# Altium project Chair_Speaker_TI_Receiver_REV1-1.PrjPcb
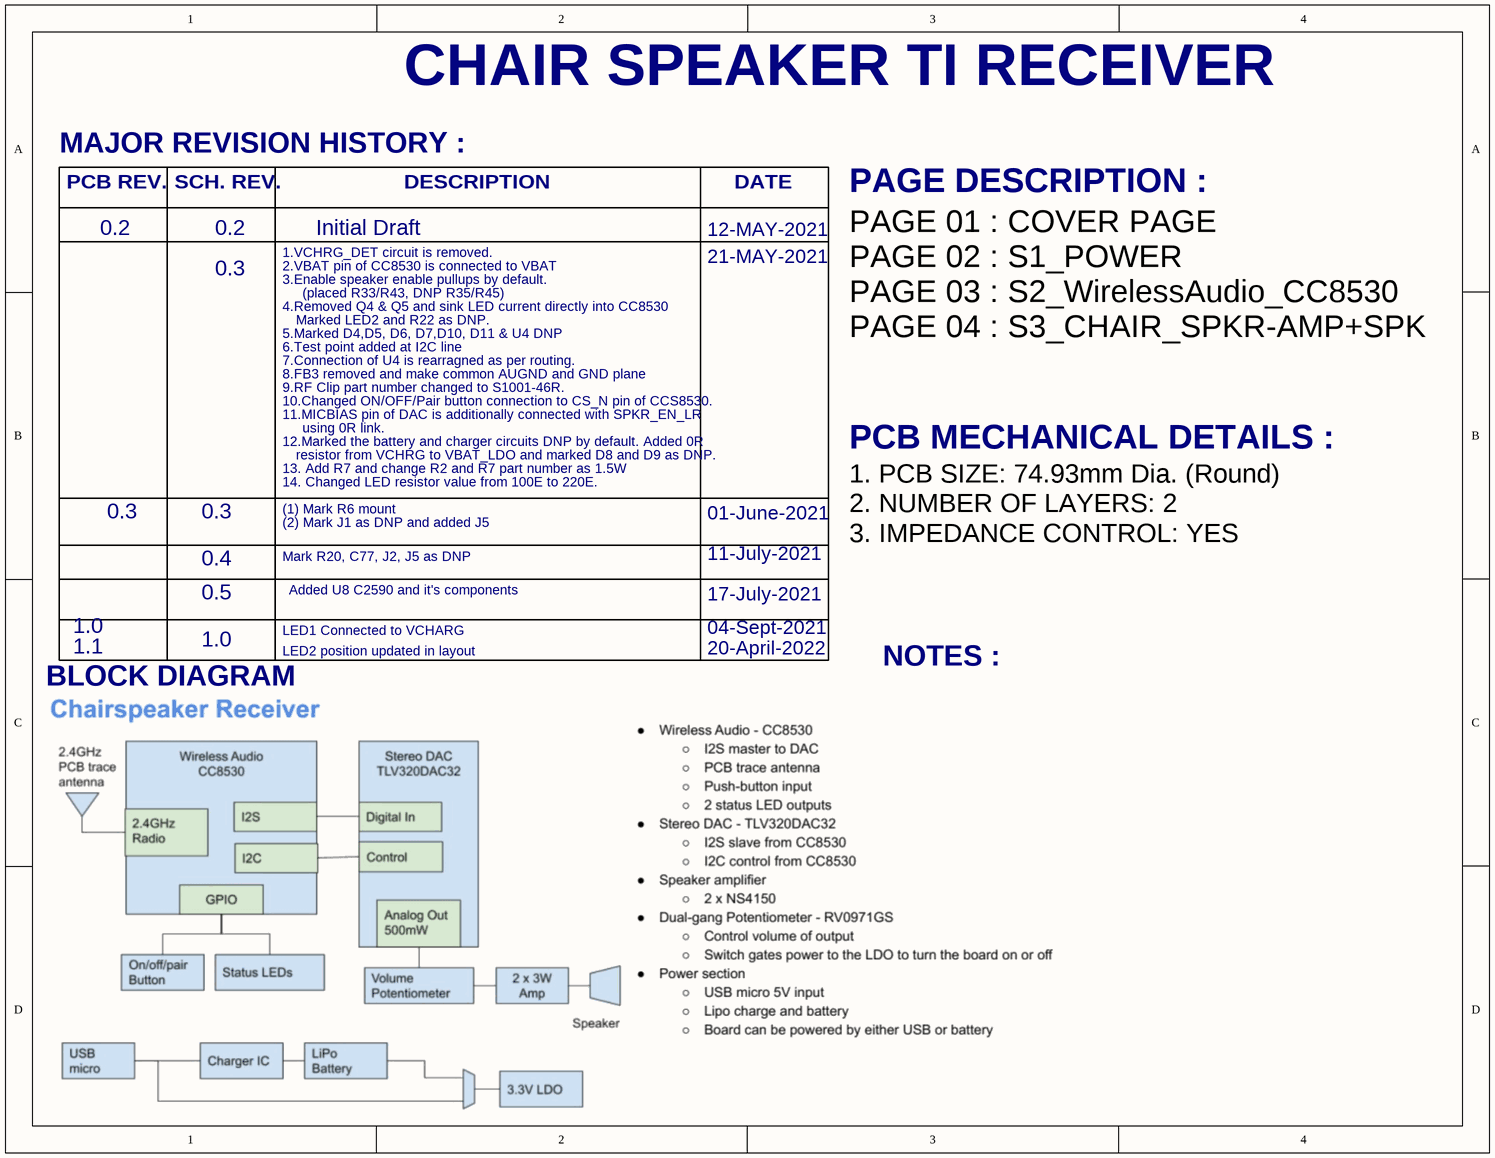
[diagram p0: S0_COVER_PAGE.SchDoc]
GlobalProjectRevision: REV1-1; GlobalProjectName: Chairspeaker TI Receiver; .PCBSolderMaskSides: Both; .PCBSolderMaskColor: Green; .PCBSilkscreenSides: Both; .PCBSilkscreenColor: White; .PCBFinishThickness: 1.6; .pcbfinishPlating: ENIG; .GlobalProjectCustomer: Plastimold
4 sheets, 184 parts. Net scope: global (net labels, ports and power ports of the same name join across sheets).
Board file: Chair_Speaker_TI_Receiver_REV1-1.PcbDoc
Sheets:
  S0_COVER_PAGE.SchDoc
  S1_POWER.SchDoc
  S2_WirelessAudio_CC8530.SchDoc
  S3_CHAIR_SPKR-AMP+SPK.SchDoc

## Sheet S0_COVER_PAGE.SchDoc
size Letter; DocumentNumber: 1; Revision: 1-0; SheetNumber: 0; SheetTotal: 6

### Notes on the sheet
- CHAIR SPEAKER TI RECEIVER
- MAJOR REVISION HISTORY :
- PCB REV.
- 0.2
- SCH. REV.
- Initial Draft
- DESCRIPTION
- 12-MAY-2021
- DATE
- PAGE DESCRIPTION :
- 0.3
- 1.VCHRG_DET circuit is removed.
- 2.VBAT pin of CC8530 is connected to VBAT
- 3.Enable speaker enable pullups by default.
- (placed R33/R43, DNP R35/R45)
- 21-MAY-2021
- 4.Removed Q4 & Q5 and sink LED current directly into CC8530
- 5.Marked D4,D5, D6, D7,D10, D11 & U4 DNP
- 6.Test point added at I2C line
- 7.Connection of U4 is rearragned as per routing.
- Marked LED2 and R22 as DNP.
- PAGE 01 : COVER PAGE
  PAGE 02 : S1_POWER
  PAGE 03 : S2_WirelessAudio_CC8530
  PAGE 04 : S3_CHAIR_SPKR-AMP+SPK
- 8.FB3 removed and make common AUGND and GND plane
- 9.RF Clip part number changed to S1001-46R.
- 10.Changed ON/OFF/Pair button connection to CS_N pin of CCS8530.
- 11.MICBIAS pin of DAC is additionally connected with SPKR_EN_LR
- using 0R link.
- 12.Marked the battery and charger circuits DNP by default. Added 0R
- 13. Add R7 and change R2 and R7 part number as 1.5W
- 14. Changed LED resistor value from 100E to 220E.
- resistor from VCHRG to VBAT_LDO and marked D8 and D9 as DNP.
- PCB MECHANICAL DETAILS :
- 0.4
- (1) Mark R6 mount
- (2) Mark J1 as DNP and added J5
- Mark R20, C77, J2, J5 as DNP
- 01-June-2021
- 11-July-2021
- 1. PCB SIZE: 74.93mm Dia. (Round)
  2. NUMBER OF LAYERS: 2
  3. IMPEDANCE CONTROL: YES
- 1.0
- 0.5
- LED1 Connected to VCHARG
- Added U8 C2590 and it's components
- 17-July-2021
- 04-Sept-2021
- BLOCK DIAGRAM
- 1.1
- LED2 position updated in layout
- 20-April-2022
- NOTES :
- Title
- Size:
- Date:
- B
- Number:
- Time:
- Revision:
- Sheet
- of
- File:

## Sheet S1_POWER.SchDoc
size 431 x 279 mm; Revision: 1-0; SheetNumber: 2; SheetTotal: 4; CustomerName: PLASTIMOLD; .GlobalProjectCustomer: PLASTIMOLD; ProjectName: Chairspeaker TI Receiver
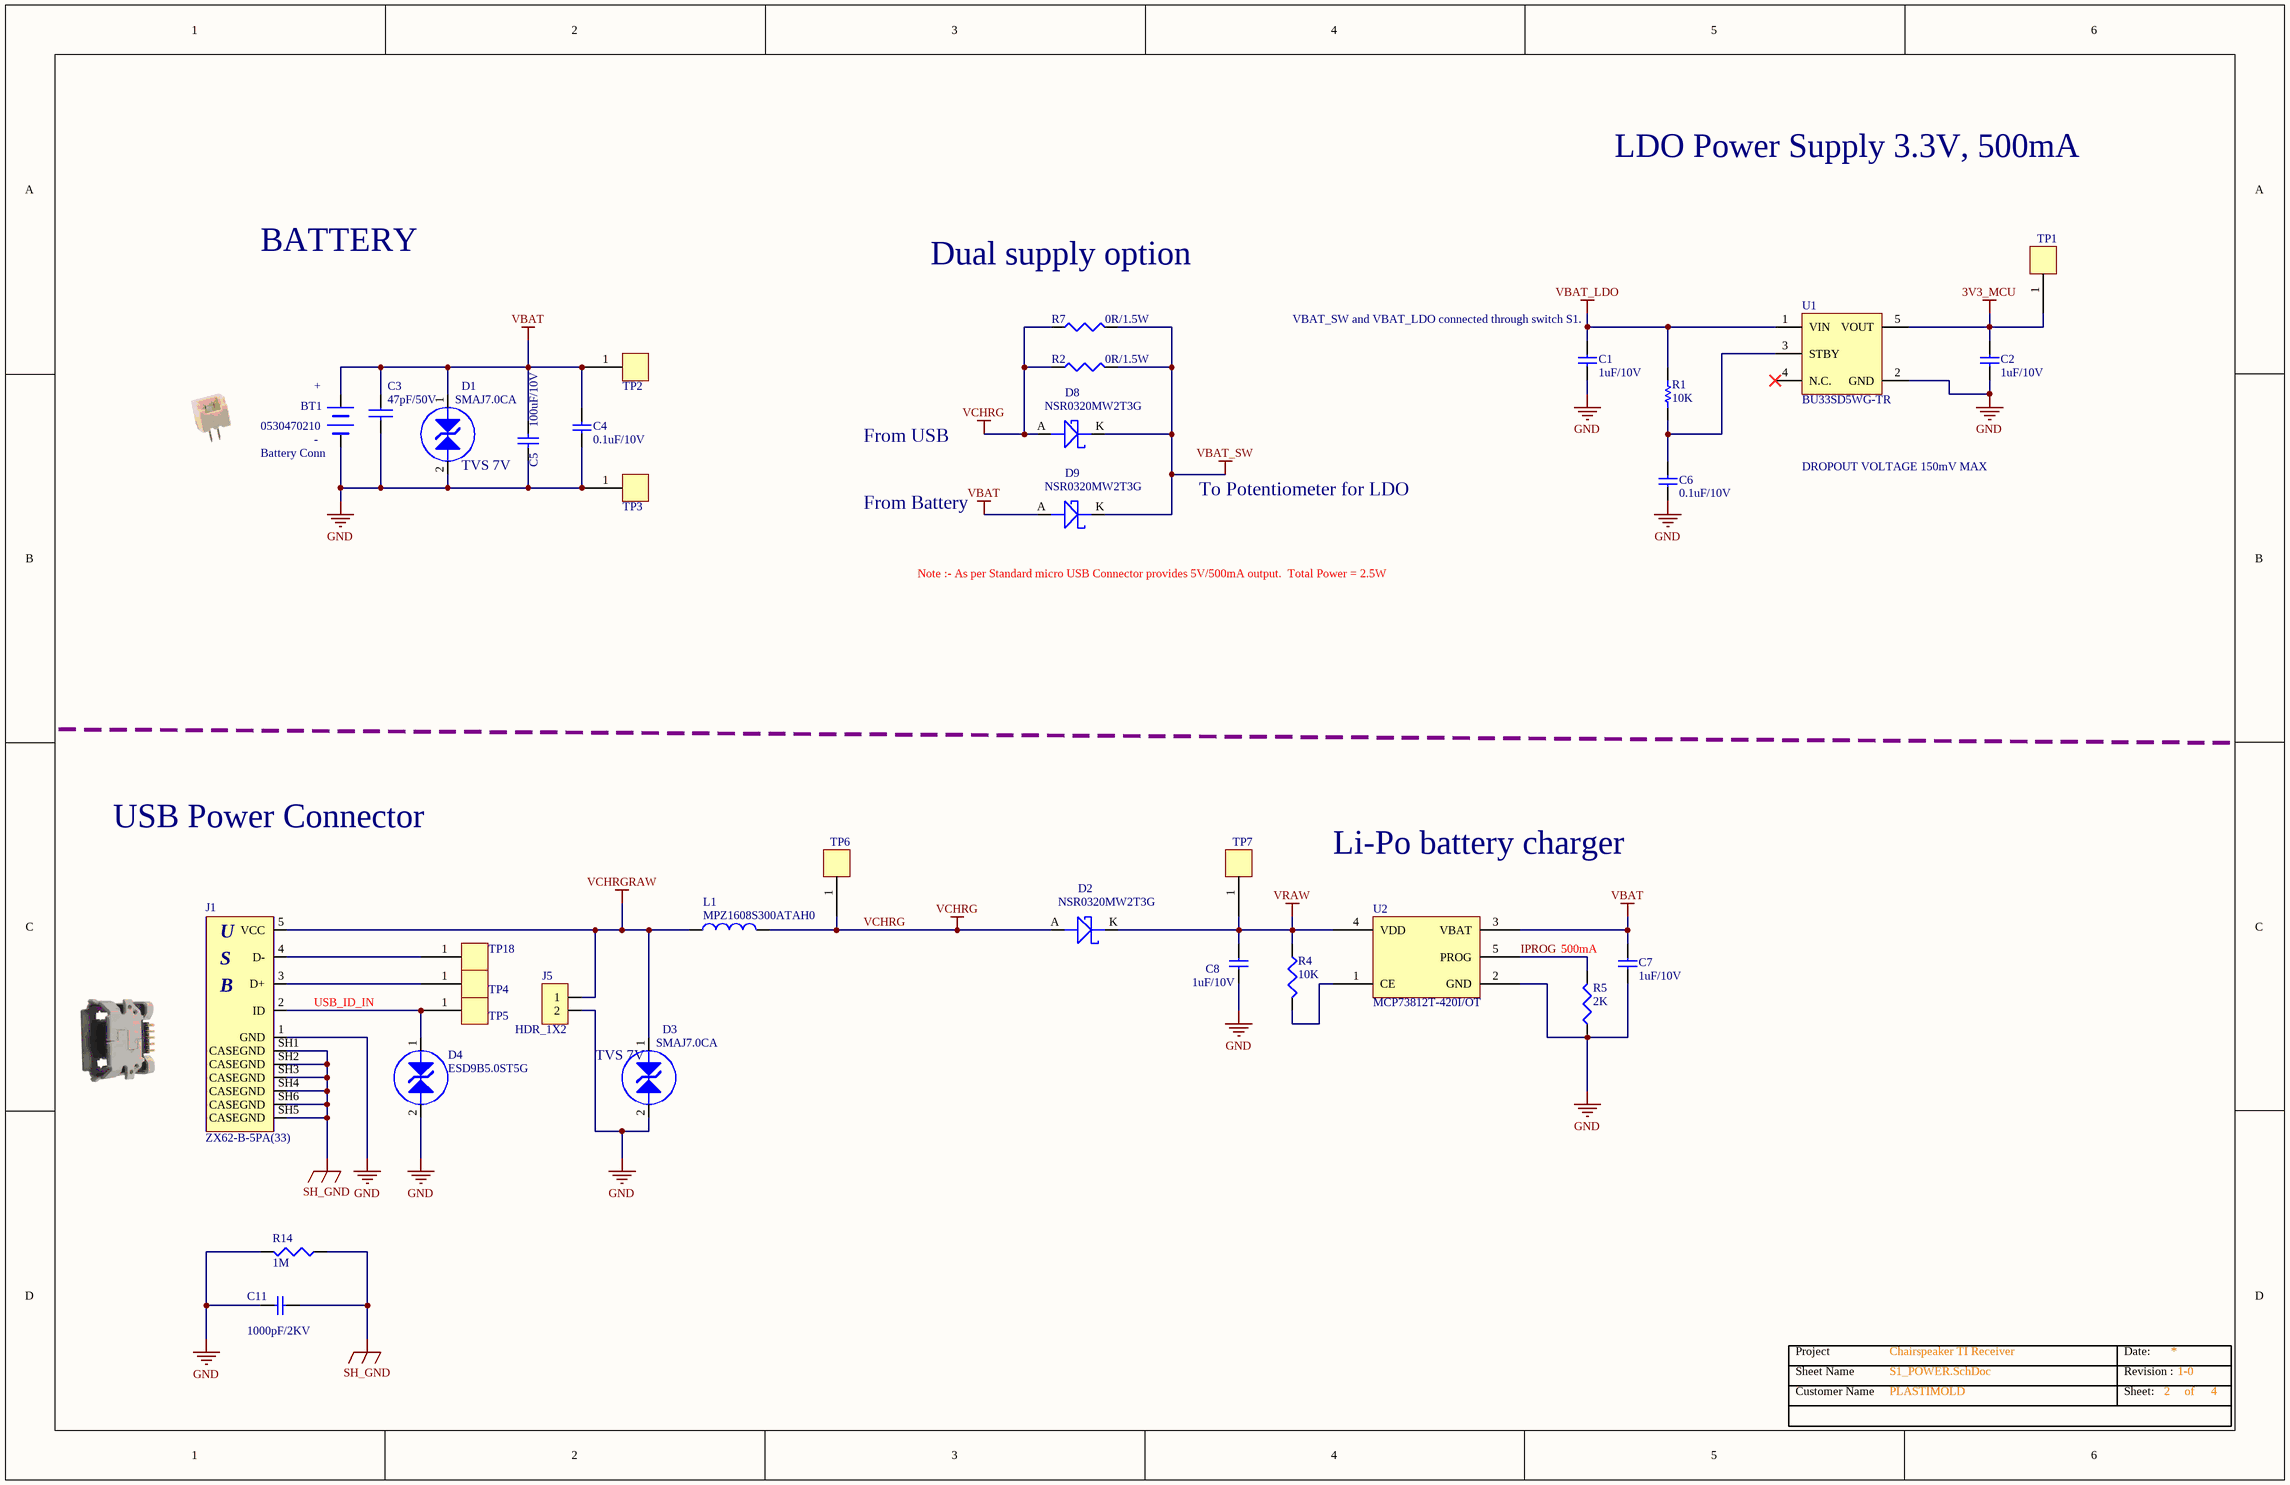
[diagram p1: S1_POWER.SchDoc]

### Parts
BT1  0530470210  [0530470210]
C1  1uF/10V  [CAP_0402_(M1005)]
C2  1uF/10V  [CAP_0402_(M1005)]
C3  47pF/50V  [CAP_0402_(M1005)]
C4  0.1uF/10V  [CAP_0402_(M1005)]
C5  100uF/10V  [CAP_1210_3225]
C6  0.1uF/10V  [CAP_0402_(M1005)]
C7  1uF/10V  [CAP_0402_(M1005)]
C8  1uF/10V  [CAP_0402_(M1005)]
C11  1000pF/2KV  [CAP_1206_(M3016)]
D1  SMAJ7.0CA  [DO-214AC (SMA)_BI_DIRECTION]
D2  NSR0320MW2T3G  [SOD-323]
D3  SMAJ7.0CA  [DO-214AC (SMA)_BI_DIRECTION]
D4  ESD9B5.0ST5G  [SOD-923-BI-DIRECTIONAL]
D8  NSR0320MW2T3G  [SOD-323]
D9  NSR0320MW2T3G  [SOD-323]
J1  ZX62-B-5PA(33)  [USB_MICRODBG]
J5  HDR_1X2  [HDR_1X2]
L1  MPZ1608S300ATAH0  [IND_0603_(M1608)]
R1  10K  [RES_0402_(M1005)]
R2  value 0R/1.5W  [RES_2512_(M6432)]  (hidden comment: 0R)
R4  10K  [RES_0402_(M1005)]
R5  2K  [RES_0402_(M1005)]
R7  value 0R/1.5W  [RES_2512_(M6432)]  (hidden comment: 0R)
R14  1M  [RES_0402_(M1005)]
TP1  TP  [TestP SM 30MIL ROUND]  (value not drawn)  (no BOM)
TP2  TP  [TestP SM 30MIL ROUND]  (value not drawn)  (no BOM)
TP3  TP  [TestP SM 30MIL ROUND]  (value not drawn)  (no BOM)
TP4  TP  [TestP SM 30MIL ROUND]  (value not drawn)  (no BOM)
TP5  TP  [TestP SM 30MIL ROUND]  (value not drawn)  (no BOM)
TP6  TP  [TestP SM 30MIL ROUND]  (value not drawn)  (no BOM)
TP7  TP  [TestP SM 30MIL ROUND]  (value not drawn)  (no BOM)
TP18  TP  [TestP SM 30MIL ROUND]  (value not drawn)  (no BOM)
U1  BU33SD5WG-TR  [SSOP5]
U2  MCP73812T-420I/OT  [SOT23-5]

### Nets
3V3_MCU: C2.2 TP1.1 U1.5(VOUT)
GND: BT1.1 C1.1 C2.1 C3.2 C4.2 C5.2 C6.2 C7.1 C8.1 C11.1 D1.2 D3.2 D4.2 J1.1(GND) J5.2 R5.1 R14.1 TP3.1 U1.2(GND) U2.2(GND)
SH_GND: C11.2 J1.SH1(CASEGND) J1.SH2(CASEGND) J1.SH3(CASEGND) J1.SH4(CASEGND) J1.SH5(CASEGND) J1.SH6(CASEGND) R14.2
VBAT: BT1.2 C3.1 C4.1 C5.1 C7.2 D1.1 D9.A(ANOD) TP2.1 U2.3(VBAT)
VBAT_LDO: C1.2 R1.1 U1.1(VIN)
VBAT_SW: D8.K(CATH) D9.K(CATH) R2.2 R7.2
VCHRG: D2.A(ANOD) D8.A(ANOD) L1.2 R2.1 R7.1 TP6.1
VCHRGRAW: D3.1 J1.5(VCC) J5.1 L1.1
VRAW: C8.2 D2.K(CATH) R4.1 TP7.1 U2.4(VDD)
IPROG: R5.2 U2.5(PROG)
USB_ID_IN: D4.1 J1.2(ID) TP5.1
NetC6_1: C6.1 R1.2 U1.3(STBY)
NetJ1_3: J1.3(D+) TP4.1
NetJ1_4: J1.4(D-) TP18.1
NetR4_2: R4.2 U2.1(CE)

Not connected (* = marked no-connect by the designer): U1 4(N.C.)*

### Notes on the sheet
- LDO Power Supply 3.3V, 500mA
- BATTERY
- Dual supply option
- (near C1) VBAT_SW and VBAT_LDO connected through switch S1.
- (near BT1) +
- (near BT1) Battery Conn
- (near BT1) -
- (near D1) TVS 7V
- From USB
- To Potentiometer for LDO
- DROPOUT VOLTAGE 150mV MAX
- From Battery
- Note :- As per Standard micro USB Connector provides 5V/500mA output.  Total Power = 2.5W
- USB Power Connector
- Li-Po battery charger
- 500mA
- (near D3) TVS 7V
- Sheet Name
- Project
- Date:
- Revision :
- Customer Name
- Sheet:
- of
- (in symbol CONN_USB_MINI_B) U; S; B

### Library data of the parts
BT1 = BATTERY: =Description1; pin to pad: 1>2 2>1; Manufacturer 1: Molex; Description1: CONN HEADER VERT 2POS 1.25MM; Cross Allowed: YES; Manufacturer Part Number 1: 0530470210; value: 0530470210
C1 C2 C7 C8 = CAP: =Description1; Manufacturer 1: Murata Electronics; Manufacturer Part Number 1: GRM155R61A105KE15D; Description1: CAP CER 1UF 10V X5R 0402; Cross Allowed: YES; Value: 1uF/10V
C3 = CAP NP: =Description1; Manufacturer 1: Yageo; Manufacturer Part Number 1: CC0402JRNPO9BN470; Description1: CAP CER 47PF 50V C0G/NPO 0402; Cross Allowed: YES; VALUE: 47pF/50V
C4 C6 = CAP: =Description1; Manufacturer 1: Yageo; Manufacturer Part Number 1: CC0402KRX7R6BB104; Description1: CAP CER 0.1UF 10V X7R 0402; Cross Allowed: YES; Value: 0.1uF/10V
C5 = C3216JB1A107M160AC: =Description1; Manufacturer Part Number 1: CL32A107MPVNNNE; Manufacturer 1: Samsung Electro-Mechanics; Description1: CAP CER 100UF 10V X5R 20% 1210; Cross Allowed: YES; Value: 100uF/10V
C11 = GRM155R61A104KA01D: =Description1; Manufacturer 1: KEMET; Manufacturer Part Number 1: C1206C102KGRACTU; Description1: CAP CER 1000PF 2KV X7R 1206; Cross Allowed: YES; Value: 1000pF/2KV
D1 D3 = TVS-DIODE: =Description1; Manufacturer 1: Littlefuse; Description1: TVS DIODE 7VWM 12VC SMA; Cross Allowed: NO; Manufacturer Part Number 1: SMAJ7.0CA; VALUE: SMAJ7.0CA
D2 D8 D9 = DIODE SCHOTTKY: =Description1; Manufacturer 1: ON Semiconductor; Description1: DIODE SCHOTTKY 20V 1A SOD323; Cross Allowed: NO; Manufacturer Part Number 1: NSR0320MW2T3G; Value: NSR0320MW2T3G
D4 = TVS-DIODE: =Description1; Manufacturer 1: ON Semiconductor; Description1: TVS DIODE 5V SOD923; Cross Allowed: NO; Manufacturer Part Number 1: ESD9B5.0ST5G; VALUE: ESD9B5.0ST5G
J1 = CONN_USB_MINI_B: =Description1; Manufacturer 1: Hirose; Description1: CONN RCPT MICRO USB B SMD R/A; Cross Allowed: YES; Manufacturer Part Number 1: ZX62-B-5PA(33); VALUE: ZX62-B-5PA(33)
J5 = HDR_1X2: =Description1; Manufacturer 1: Harwin Inc.; Manufacturer Part Number 1: M20-9990246; Cross Allowed: YES; Description1: CONN HEADER VERT 2POS 2.54MM; Value: HDR_1X2
L1 = FERRITE BEAD: =Description1; Manufacturer 1: TDK Corporation; Description1: FERRITE BEAD 30 OHM 0603 1LN; Cross Allowed: YES; Manufacturer Part Number 1: MPZ1608S300ATAH0; Value: MPZ1608S300ATAH0
R1 = RESISTOR: =Description1; Manufacturer 1: Stackpole Electronics Inc; Manufacturer Part Number 1: RMCF0402FT10K0; Description1: RES 10K OHM 1% 1/16W 0402; Cross Allowed: YES; Value: 10K
R2 R7 = RES_0R: =Description1; Manufacturer 1: Vishay Dale; Manufacturer Part Number 1: CRCW25120000Z0EGHP; Description1: RES SMD 0 OHM JUMPER 1.5W 2512; Cross Allowed: YES
R4 = RES: =Description1; Manufacturer 1: Stackpole Electronics Inc; Manufacturer Part Number 1: RMCF0402FT10K0; Description1: RES 10K OHM 1% 1/16W 0402; Cross Allowed: YES; VALUE: 10K
R5 = RES: =Description1; Manufacturer 1: Panasonic; Manufacturer Part Number 1: ERJ-2RKF2001X; Description1: RES SMD 2K OHM 1% 1/10W 0402; Cross Allowed: YES; Value: 2K
R14 = RES: =Description1; Manufacturer 1: Panasonic; Manufacturer Part Number 1: ERJ-2RKF1004X; Description1: RES SMD 1M OHM 1% 1/10W 0402; Cross Allowed: YES; Value: 1M
TP1-TP7 TP18 = TP: =Description1; Description1: NA; Value: NA; Cross Allowed: YES; Manufacturer 1: NA; Manufacturer Part Number 1: NA
U1 = BU33SD5WG-TR: =Description1; Manufacturer 1: Rohm Semiconductor; Description1: IC REG LINEAR 3.3V 500MA 5SSOP; Cross Allowed: NO; Manufacturer Part Number 1: BU33SD5WG-TR; Value: BU33SD5WG-TR
U2 = CHG_MCP73812: =Description1; Manufacturer 1: MICROCHIP; Description1: CHARGER IC LI-ION/LI-POLY SOT23-5; Cross Allowed: NO; Manufacturer Part Number 1: MCP73812T-420I/OT; VALUE: MCP73812T-420I/OT

## Sheet S2_WirelessAudio_CC8530.SchDoc
size 431 x 279 mm; Revision: 1-0; SheetNumber: 3; SheetTotal: 4; CustomerName: PLASTIMOLD; .GlobalProjectCustomer: PLASTIMOLD; ProjectName: Chairspeaker TI Receiver
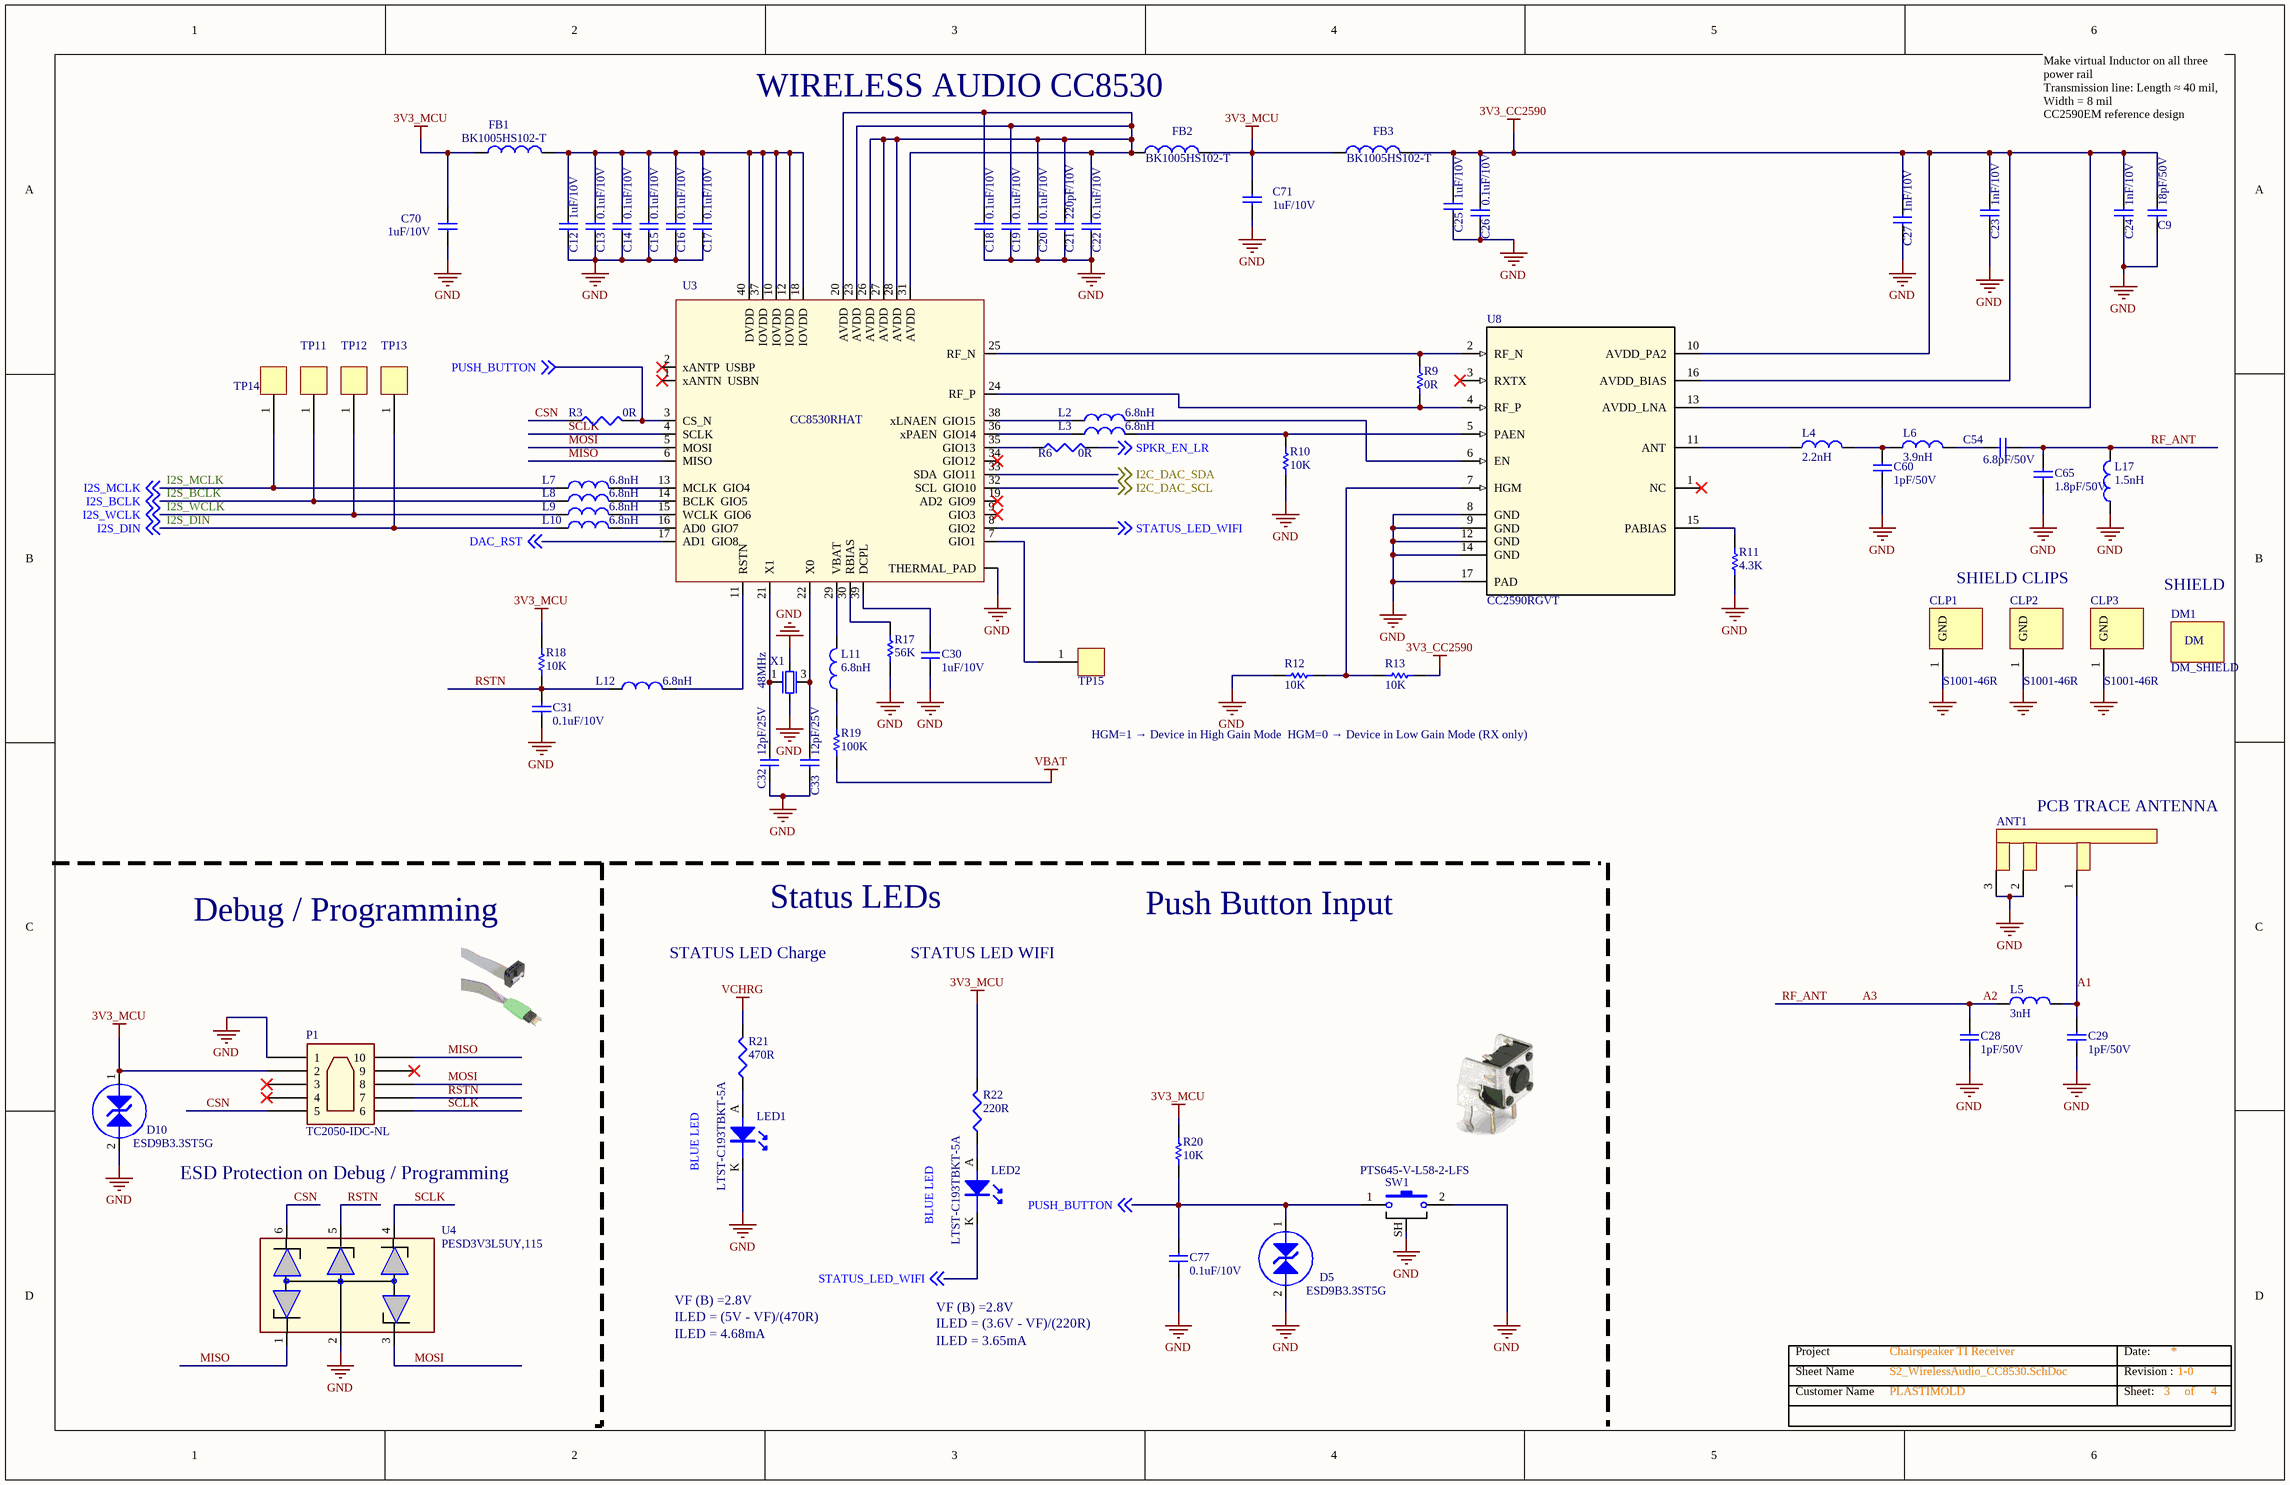
[diagram p2: S2_WirelessAudio_CC8530.SchDoc]

### Parts
ANT1  INVERTED F ANTENNA  [ANT]  (value not drawn)  (no BOM)
C9  18pF/50V  [CAP_0402_(M1005)]
C12  1uF/10V  [CAP_0402_(M1005)]
C13  0.1uF/10V  [CAP_0402_(M1005)]
C14  0.1uF/10V  [CAP_0402_(M1005)]
C15  0.1uF/10V  [CAP_0402_(M1005)]
C16  0.1uF/10V  [CAP_0402_(M1005)]
C17  0.1uF/10V  [CAP_0402_(M1005)]
C18  0.1uF/10V  [CAP_0402_(M1005)]
C19  0.1uF/10V  [CAP_0402_(M1005)]
C20  0.1uF/10V  [CAP_0402_(M1005)]
C21  220pF/10V  [CAP_0402_(M1005)]
C22  0.1uF/10V  [CAP_0402_(M1005)]
C23  1nF/10V  [CAP_0402_(M1005)]
C24  1nF/10V  [CAP_0402_(M1005)]
C25  1uF/10V  [CAP_0402_(M1005)]
C26  0.1uF/10V  [CAP_0402_(M1005)]
C27  1nF/10V  [CAP_0402_(M1005)]
C28  1pF/50V  [CAP_0402_(M1005)]
C29  1pF/50V  [CAP_0402_(M1005)]
C30  1uF/10V  [CAP_0402_(M1005)]
C31  0.1uF/10V  [CAP_0402_(M1005)]
C32  12pF/25V  [CAP_0402_(M1005)]
C33  12pF/25V  [CAP_0402_(M1005)]
C54  6.8pF/50V  [CAP_0402_(M1005)]
C60  1pF/50V  [CAP_0402_(M1005)]
C65  1.8pF/50V  [CAP_0402_(M1005)]
C70  1uF/10V  [CAP_0402_(M1005)]
C71  1uF/10V  [CAP_0402_(M1005)]
C77  0.1uF/10V  [CAP_0402_(M1005)]
CLP1  S1001-46R  [S1001-46R]
CLP2  S1001-46R  [S1001-46R]
CLP3  S1001-46R  [S1001-46R]
D5  ESD9B3.3ST5G  [SOD-923-BI-DIRECTIONAL]
D10  ESD9B3.3ST5G  [SOD-923-BI-DIRECTIONAL]
DM1  DM_SHIELD
FB1  BK1005HS102-T  [IND_0402_(M1005)]
FB2  BK1005HS102-T  [IND_0402_(M1005)]
FB3  BK1005HS102-T  [IND_0402_(M1005)]
L2  6.8nH  [IND_0402_(M1005)]
L3  6.8nH  [IND_0402_(M1005)]
L4  2.2nH  [IND_0402_(M1005)]
L5  3nH  [IND_0402_(M1005)]
L6  3.9nH  [IND_0402_(M1005)]
L7  6.8nH  [IND_0402_(M1005)]
L8  6.8nH  [IND_0402_(M1005)]
L9  6.8nH  [IND_0402_(M1005)]
L10  6.8nH  [IND_0402_(M1005)]
L11  6.8nH  [IND_0402_(M1005)]
L12  6.8nH  [IND_0402_(M1005)]
L17  1.5nH  [IND_0402_(M1005)]
LED1  LTST-C193TBKT-5A  [LED0603_TM]
LED2  LTST-C193TBKT-5A  [LED0603_TM]
P1  TC2050-IDC-NL  [TC2050-IDC-NL]
R3  0R  [RES_0402_(M1005)]
R6  0R  [RES_0402_(M1005)]
R9  0R  [RES_0402_(M1005)]
R10  10K  [RES_0402_(M1005)]
R11  4.3K  [RES_0402_(M1005)]
R12  10K  [RES_0402_(M1005)]
R13  10K  [RES_0402_(M1005)]
R17  56K  [IND_0402_(M1005)]
R18  10K  [RES_0402_(M1005)]
R19  100K  [RES_0402_(M1005)]
R20  10K  [RES_0402_(M1005)]
R21  470R  [RES_0402_(M1005)]
R22  220R  [RES_0402_(M1005)]
SW1  PTS645-V-L58-2-LFS  [SWITCH-PTS645-VL]
TP11  TP  [TestP SM 30MIL ROUND]  (value not drawn)  (no BOM)
TP12  TP  [TestP SM 30MIL ROUND]  (value not drawn)  (no BOM)
TP13  TP  [TestP SM 30MIL ROUND]  (value not drawn)  (no BOM)
TP14  TP  [TestP SM 30MIL ROUND]  (value not drawn)  (no BOM)
TP15  TP  [TestP SM 30MIL ROUND]  (value not drawn)  (no BOM)
U3  CC8530RHAT  [VFQFN40]
U4  PESD3V3L5UY,115  [SOT-363]
U8  CC2590RGVT  [QFN65P400X400X100-17N-D]
X1  48MHz  [ECX-2236B]

### Nets
3V3_CC2590: C9.2 C23.2 C24.2 C25.2 C26.2 C27.2 FB3.2 R13.2 U8.10(AVDD_PA2) U8.13(AVDD_LNA) U8.16(AVDD_BIAS)
3V3_MCU: C70.2 C71.2 D10.1 FB1.1 FB2.2 FB3.1 P1.2 R18.1 R20.1 R22.2
GND: ANT1.2 ANT1.3 C9.1 C12.1 C13.1 C14.1 C15.1 C16.1 C17.1 C18.1 C19.1 C20.1 C21.1 C22.1 C23.1 C24.1 C25.1 C26.1 C27.1 C28.2 C29.2 C30.1 C31.1 C32.2 C33.2 C60.2 C65.1 C70.1 C71.1 C77.2 CLP1.1(GND) CLP2.1(GND) CLP3.1(GND) D5.2 D10.2 L17.1 LED1.K P1.1 R10.2 R11.1 R12.1 R17.2 SW1.2 SW1.SH U3.GND(THERMAL_PAD) U4.2(GND) U8.8(GND) U8.9(GND) U8.12(GND) U8.14(GND) U8.17(PAD) X1.2 X1.4
VBAT: R19.2
VCHRG: R21.2
A1: ANT1.1 C29.1 L5.2
A2: C28.1 C54.2 C65.2 L5.1 L17.2  [also labelled A3, RF_ANT]
CSN: P1.5 R3.1 U4.6(I/O4)
DAC_RST: U3.17(AD1__GIO8) ; off-sheet DAC_RST
I2C_DAC_SCL: U3.32(SCL__GIO10) ; off-sheet I2C_DAC_SCL
I2C_DAC_SDA: U3.33(SDA__GIO11) ; off-sheet I2C_DAC_SDA
I2S_BCLK: L8.1 TP11.1 ; off-sheet I2S_BCLK
I2S_DIN: L10.1 TP13.1 ; off-sheet I2S_DIN
I2S_MCLK: L7.1 TP14.1 ; off-sheet I2S_MCLK
I2S_WCLK: L9.1 TP12.1 ; off-sheet I2S_WCLK
MISO: P1.10 U3.6(MISO) U4.1(I/O1)
MOSI: P1.8 U3.5(MOSI) U4.3(I/O2)
PUSH_BUTTON: C77.1 D5.1 R3.2 R20.2 SW1.1 U3.3(CS_N) ; off-sheet PUSH_BUTTON
RSTN: C31.2 L12.1 P1.7 R18.2 U4.5(VDD)
SCLK: P1.6 U3.4(SCLK) U4.4(I/O3)
SPKR_EN_LR: R6.2 ; off-sheet SPKR_EN_LR
STATUS_LED_WIFI: LED2.K U3.8(GIO2) ; off-sheet STATUS_LED_WIFI
NetC12_2: C12.2 C13.2 C14.2 C15.2 C16.2 C17.2 FB1.2 U3.10(IOVDD) U3.12(IOVDD) U3.18(IOVDD) U3.37(IOVDD) U3.40(DVDD)
NetC18_2: C18.2 C19.2 C20.2 C21.2 C22.2 FB2.1 U3.20(AVDD) U3.23(AVDD) U3.26(AVDD) U3.27(AVDD) U3.28(AVDD) U3.31(AVDD)
NetC30_2: C30.2 U3.39(DCPL)
NetC32_1: C32.1 U3.21(X1) X1.1
NetC33_1: C33.1 U3.22(X0) X1.3
NetC54_1: C54.1 L6.2
NetC60_1: C60.1 L4.2 L6.1
NetL2_1: L2.1 U3.38(xLNAEN__GIO15)
NetL2_2: L2.2 U8.6(EN)
NetL3_1: L3.1 U3.36(xPAEN__GIO14)
NetL3_2: L3.2 R10.1 U8.5(PAEN)
NetL4_1: L4.1 U8.11(ANT)
NetL7_2: L7.2 U3.13(MCLK__GIO4)
NetL8_2: L8.2 U3.14(BCLK__GIO5)
NetL9_2: L9.2 U3.15(WCLK__GIO6)
NetL10_2: L10.2 U3.16(AD0__GIO7)
NetL11_1: L11.1 R19.1
NetL11_2: L11.2 U3.29(VBAT)
NetL12_2: L12.2 U3.11(RSTN)
NetLED1_A: LED1.A R21.1
NetLED2_A: LED2.A R22.1
NetR6_1: R6.1 U3.35(GIO13)
NetR9_1: R9.1 U3.24(RF_P) U8.4(RF_P)
NetR9_2: R9.2 U3.25(RF_N) U8.2(RF_N)
NetR11_2: R11.2 U8.15(PABIAS)
NetR12_2: R12.2 R13.1 U8.7(HGM)
NetR17_1: R17.1 U3.30(RBIAS)
NetTP15_1: TP15.1 U3.7(GIO1)

Not connected (* = marked no-connect by the designer): P1 3* 4* 9*; U3 1(xANTN__USBN)* 2(xANTP__USBP)* 9(GIO3)* 19(AD2__GIO9)* 34(GIO12)*; U8 1(NC)* 3(RXTX)*

### Notes on the sheet
- WIRELESS AUDIO CC8530
- Make virtual Inductor on all three power rail
  Transmission line: Length ≈ 40 mil, Width = 8 mil
  CC2590EM reference design
- SHIELD CLIPS
- SHIELD
- HGM=1 → Device in High Gain Mode  HGM=0 → Device in Low Gain Mode (RX only)
- PCB TRACE ANTENNA
- Debug / Programming
- STATUS LED Charge
- Status LEDs
- STATUS LED WIFI
- Push Button Input
- BLUE LED
- ESD Protection on Debug / Programming
- VF (B) =2.8V
- ILED = 4.68mA
- ILED = (5V - VF)/(470R)
- ILED = 3.65mA
- ILED = (3.6V - VF)/(220R)
- Sheet Name
- Project
- Date:
- Revision :
- Customer Name
- Sheet:
- of
- (in symbol DM_SHIELD) DM

### Library data of the parts
ANT1 = INVERTED_F: =Description1; Manufacturer 1: NA; Cross Allowed: NO; Description1: Inverted F Antenna; Value: Inverted F Antenna; Manufacturer Part Number 1: NA
C9 = CAP: =Description1; Manufacturer 1: Samsung Electro-Mechanics; Manufacturer Part Number 1: CL05C180JB5NNNC; Description1: CAP CER 18PF 50V C0G/NP0 0402; Cross Allowed: YES; Value: 18pF/50V
C12 C25 C30 C70 C71 = CAP: as C1 on sheet S1_POWER; Value: 1uF/10V
C13-C20 C22 C26 C31 C77 = CAP_1: =Description1; Manufacturer 1: Yageo; Manufacturer Part Number 1: CC0402KRX7R6BB104; Description1: CAP CER 0.1UF 10V X7R 0402; Cross Allowed: YES; Value: 0.1uF/10V
C21 = CAP_1: =Description1; Manufacturer 1: Würth Elektronik; Manufacturer Part Number 1: 885012005015; Description1: CAP CER 220PF 10V C0G/NP0 0402; Cross Allowed: YES; Value: 220pF/10V
C23 C24 C27 = CAP_1: =Description1; Manufacturer 1: Yageo; Manufacturer Part Number 1: CC0402KRX7R6BB103; Description1: CAP CER 10000PF 10V X7R 0402; Cross Allowed: YES; Value: 1nF/10V
C28 C29 C60 = CAP: =Description1; Manufacturer 1: AVX Corporation; Manufacturer Part Number 1: 04025A1R0KAT2A; Description1: CAP CER 1PF 50V NP0 0402; Cross Allowed: YES; Value: 1pF/50V
C32 C33 = CAP_1: =Description1; Manufacturer 1: Walsin Technology Corporation; Manufacturer Part Number 1: 0402N120J250CT; Description1: CAP CER 12PF 25V C0G/NP0 0402; Cross Allowed: YES; Value: 12pF/25V
C54 = CAP: =Description1; Manufacturer 1: Samsung Electro-Mechanics; Manufacturer Part Number 1: 04025A6R8KAT2A; Description1: CAP CER 6.8PF 50V C0G/NP0 0402; Cross Allowed: YES; Value: 6.8pF/50V
C65 = CAP: =Description1; Manufacturer 1: Samsung Electro-Mechanics; Manufacturer Part Number 1: CL05C1R8BB5NNNC; Description1: CAP CER 1.8PF 50V C0G/NP0 0402; Cross Allowed: YES; Value: 1.8pF/50V
CLP1-CLP3 = S2711-46R: =Description1; Manufacturer 1: Harwin Inc.; Description1: RFI SHIELD CLIP MICRO TIN SMD; Cross Allowed: NO; Manufacturer Part Number 1: S1001-46R; Value: S1001-46R
D5 D10 = TVS-DIODE: TVS DIODE 5V 15.5V 0402; Manufacturer 1: ON Semiconductor; Description1: TVS DIODE 3.3V 11.5V SOD923; Cross Allowed: YES; Manufacturer Part Number 1: ESD9B3.3ST5G; VALUE: ESD9B3.3ST5G
DM1 = DM_SHIELD: =Description1; Description1: TBD; Value: DM-SHIELD; Cross Allowed: NO; Manufacturer 1: TBD; Manufacturer Part Number 1: TBD
FB1-FB3 = FERRITE BEAD: =Description1; Manufacturer 1: Taiyo Yuden; Description1: FERRITE BEAD 1 KOHM 0402 1LN; Cross Allowed: YES; Manufacturer Part Number 1: BK1005HS102-T; Value: BK1005HS102-T
L2 L3 L7-L12 = IND: =Description1; Manufacturer Part Number 1: HK10056N8J-T; Manufacturer 1: Taiyo Yuden; Description1: FIXED IND 6.8NH 430MA 250 MOHM; Cross Allowed: YES; Value: 6.8nH
L4 = IND: =Description1; Manufacturer Part Number 1: LQG15HS2N2S02D; Manufacturer 1: Murata Electronics; Description1: FIXED IND 2.2NH 900MA 120MOHM SM; Cross Allowed: YES; Value: 2.2nH
L5 = IND: =Description1; Manufacturer Part Number 1: LQG15HS3N0S02D; Manufacturer 1: Murata Electronics; Description1: FIXED IND 3NH 800MA 125 MOHM SMD; Cross Allowed: YES; Value: 3nH
L6 = IND: =Description1; Manufacturer Part Number 1: LQG15HS3N9S02D; Manufacturer 1: Murata Electronics; Description1: FIXED IND 3.9NH 750MA 180MOHM SM; Cross Allowed: YES; Value: 3.9nH
L17 = IND: =Description1; Manufacturer Part Number 1: LQG15HS1N5S02D; Manufacturer 1: Murata Electronics; Description1: FIXED IND 1.5NH 1A 100 MOHM SMD; Cross Allowed: YES; Value: 1.5nH
LED1 LED2 = LED: LED GREEN 0603 SMD; Manufacturer 1: LITEON; Description1: LED BLUE CLEAR CHIP 0603 SMD; Cross Allowed: YES; Manufacturer Part Number 1: LTST-C193TBKT-5A; VALUE: LTST-C193TBKT-5A
P1 = TC2050-IDC: =Description1; Manufacturer 1: TAG-CONNECT; Description1: PROGRAMMING CABLE PLUG-OF-NAILS; Cross Allowed: NO; Manufacturer Part Number 1: TC2050-IDC-NL; VALUE: TC2050-IDC-NL
R3 R6 = RES_0R: =Description1; Manufacturer 1: Panasonic Electronic Components; Manufacturer Part Number 1: ERJ-2GE0R00X; Description1: RES 0R JUMPER 1/10W 0402; Cross Allowed: YES; Value: 0R
R9 = RC1206JR-070RL: =Description1; Manufacturer 1: Panasonic Electronic Components; Manufacturer Part Number 1: ERJ-2GE0R00X; Description1: RES 0R JUMPER 1/10W 0402; Cross Allowed: YES; Value: 0R
R10 R12 R13 R18 R20 = RESISTOR: as R1 on sheet S1_POWER; Value: 10K
R11 = RESISTOR: =Description1; Manufacturer 1: KOA Speer Electronics, Inc.; Manufacturer Part Number 1: RK73H1ETTP4301F; Description1: RES 4.3K OHM 1% 1/10W 0402; Cross Allowed: YES; Value: 4.3K
R17 = RC1206JR-070RL: =Description1; Manufacturer 1: Stackpole Electronics Inc; Manufacturer Part Number 1: RMCF0402FT56K0; Description1: RES 56K OHM 1% 1/16W 0402; Cross Allowed: YES; Value: 56K
R19 = RC1206JR-070RL: =Description1; Manufacturer 1: Stackpole Electronics Inc; Manufacturer Part Number 1: RMCF0402FT100K; Description1: RES 100K OHM 1% 1/16W 0402; Cross Allowed: YES; Value: 100K
R21 = RES: RES 470 OHM 1% 1/16W 0402; Manufacturer 1: Stackpole Electronics Inc; Manufacturer Part Number 1: RMCF0402FT470R; Cross Allowed: YES; Description1: RES 470 OHM 1% 1/16W 0402; VALUE: 470R
R22 = RES: RES 220 OHM 1% 1/16W 0402; Manufacturer 1: Stackpole Electronics Inc; Manufacturer Part Number 1: RMCF0402FT220R; Cross Allowed: YES; Description1: RES 220 OHM 1% 1/16W 0402; VALUE: 220R
SW1 = PB_SWITCH: SWITCH TACTILE SPST-NO 0.05A 12V; Manufacturer1: C&K; Cross Allowed: YES; Description1: SWITCH TACTILE SPST-NO 0.05A 12V; Manufacturer Part Number 1: PTS645-V-L58-2-LFS; Value: PTS645-V-L58-2-LFS; Manufacturer 1: C&K
TP11-TP15 = TP: as TP1 on sheet S1_POWER; Manufacturer 1: NA; Manufacturer Part Number 1: NA
U3 = CC5820: =Description1; Manufacturer 1: Texas Instruments; Description1: RF Transceiver PurePath Wireless 2.4GHz RF SoC; Cross Allowed: NO; Manufacturer Part Number 1: CC8530RHAT; Value: CC8530RHAT
U4 = PESD3V3L5UY,115: =Description1; Manufacturer 1: Nexperia USA Inc.; Description1: TVS DIODE 3.3V 12V 6TSSOP; Cross Allowed: NO; Manufacturer Part Number 1: PESD3V3L5UY,115; Value: PESD3V3L5UY,115
U8 = CC2590RGVT: No Description Available; PartNumber: CC2590RGVR; Manufacturer: Texas Instruments; Description1: IC RF FRONT END 2.4GHZ 16-QFN; RefDes: RefDes; Type: DEV; Value: Value; Copyright: Copyright (C) 2021 Accelerated Designs. All rights reserved
X1 = CRYSTAL_4PIN: =Description1; Manufacturer 1: ECS Inc.; Manufacturer Part Number 1: ECS-480-10-36B-CKM-TR; Description1: CRYSTAL 48.0000MHZ 10PF SMD; Cross Allowed: NO; Value: 48MHz

## Sheet S3_CHAIR_SPKR-AMP+SPK.SchDoc
size 431 x 279 mm; Revision: 1-0; SheetNumber: 4; SheetTotal: 4; CustomerName: PLASTIMOLD; ProjectName: Chairspeaker TI Receiver
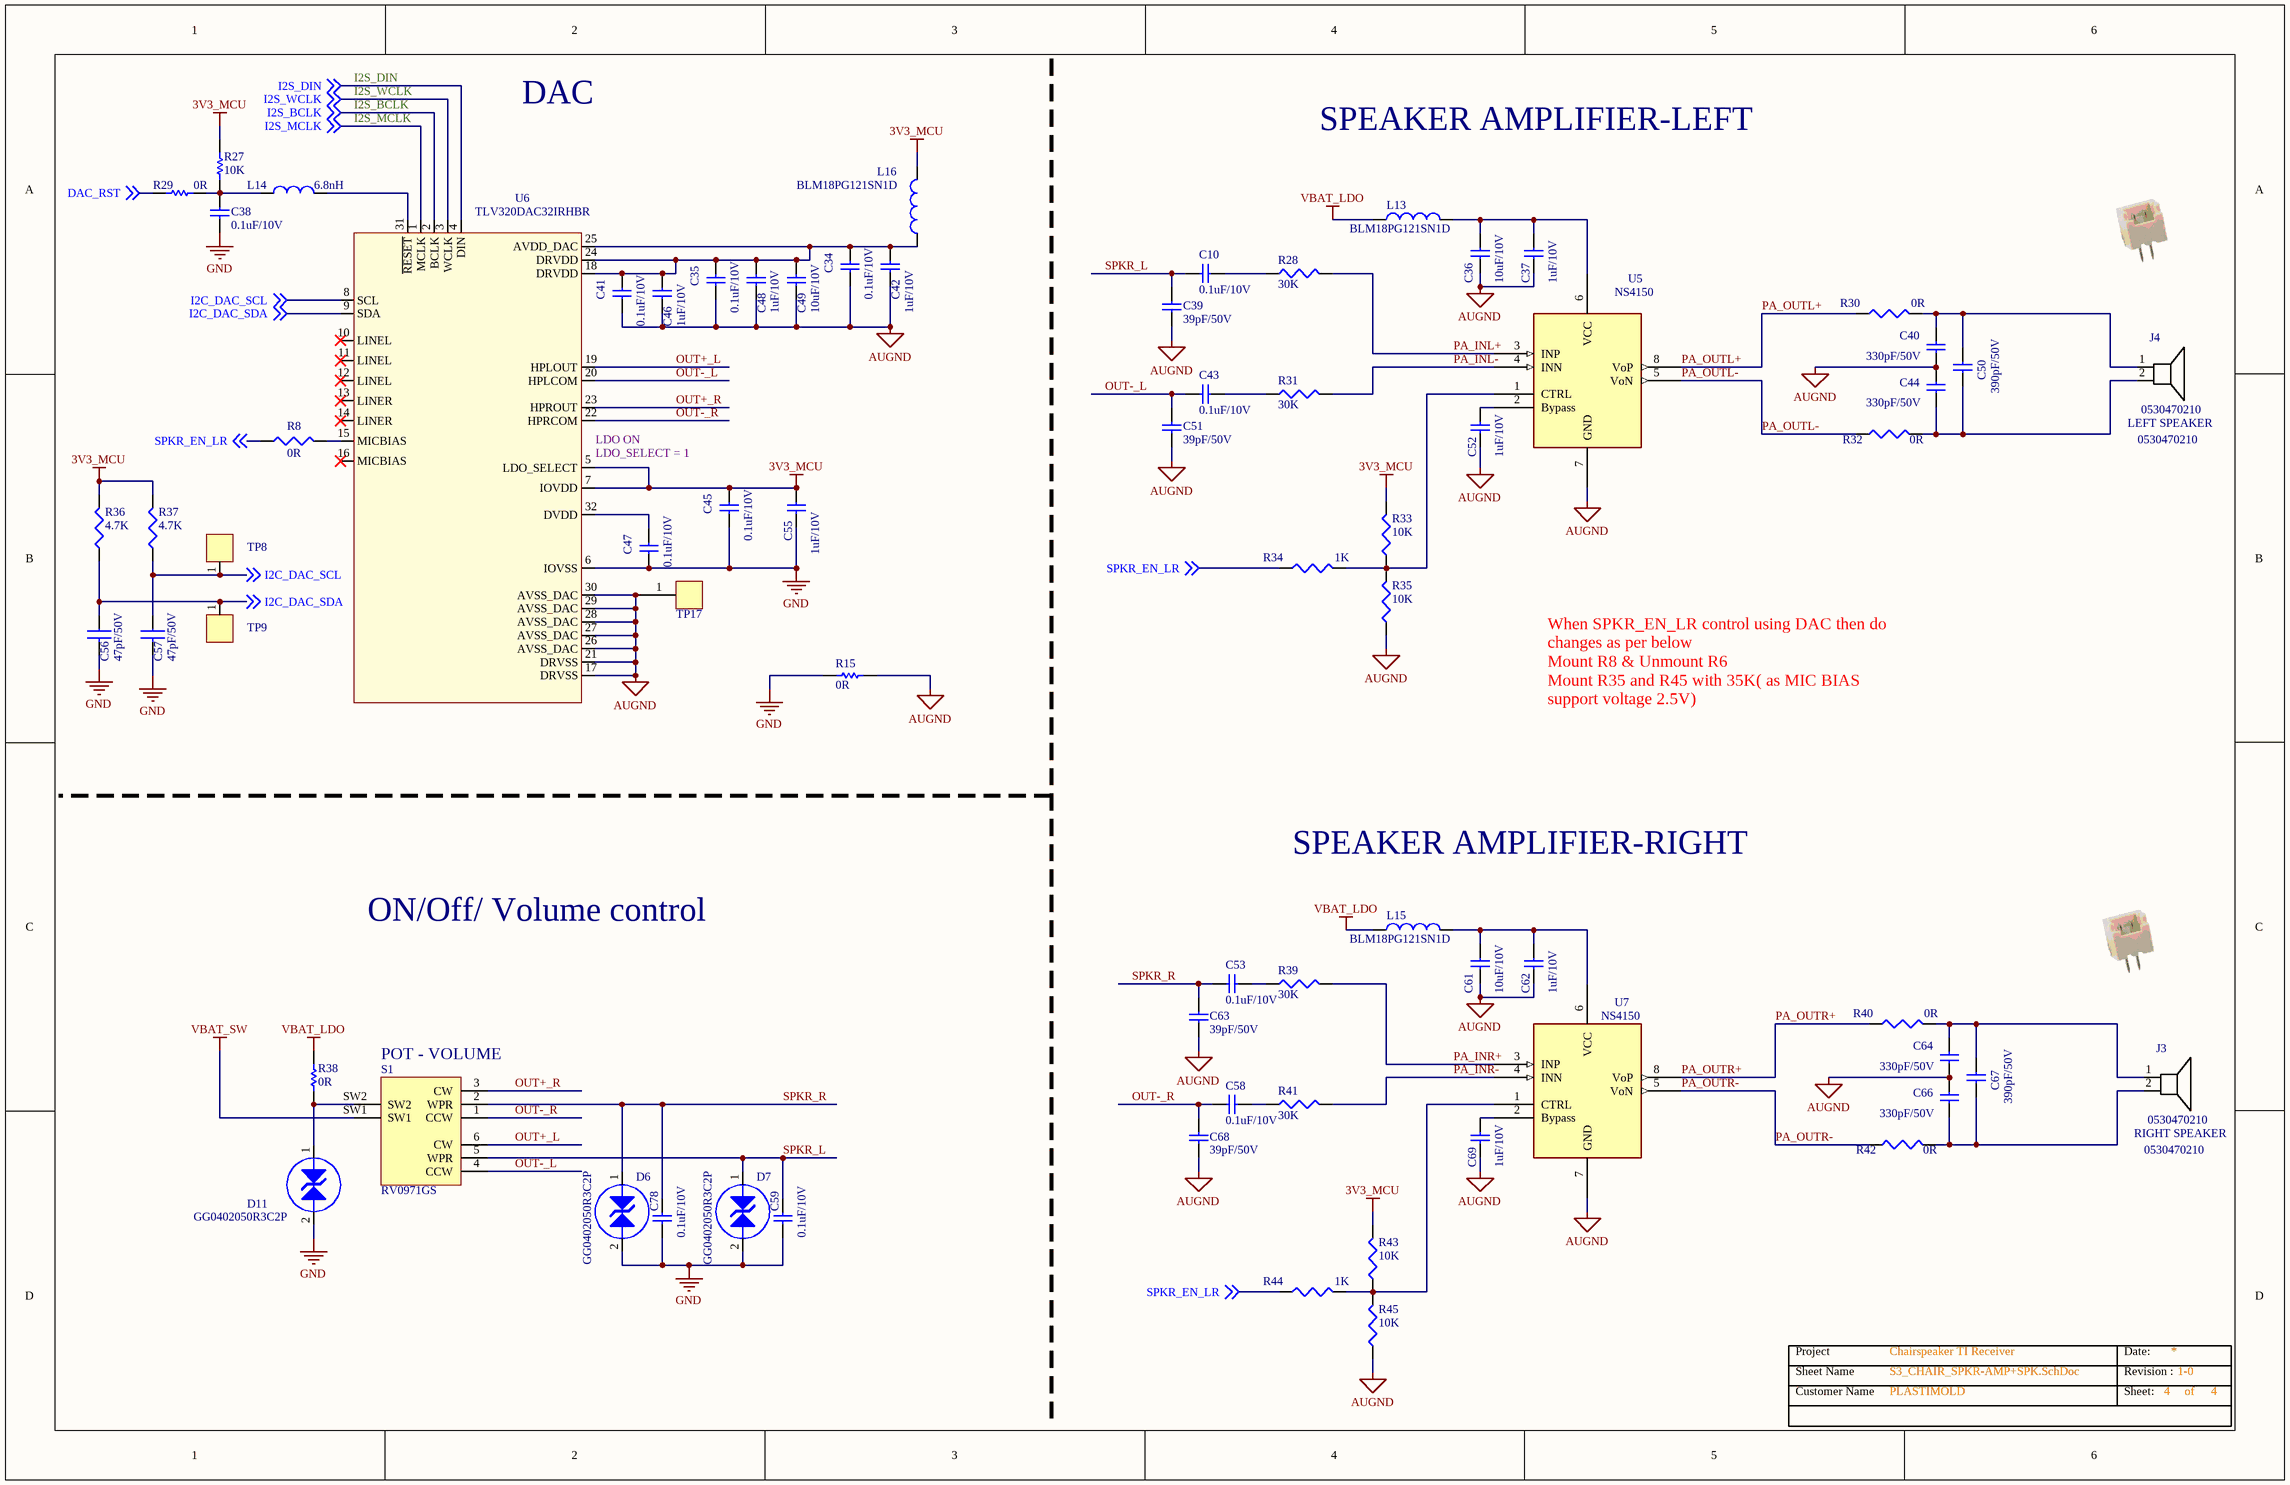
[diagram p3: S3_CHAIR_SPKR-AMP+SPK.SchDoc]

### Parts
C10  0.1uF/10V  [CAP_0402_(M1005)]
C34  0.1uF/10V  [CAP_0402_(M1005)]
C35  0.1uF/10V  [CAP_0402_(M1005)]
C36  10uF/10V  [CAP_0805_(M2012)]
C37  1uF/10V  [CAP_0402_(M1005)]
C38  0.1uF/10V  [CAP_0402_(M1005)]
C39  39pF/50V  [CAP_0402_(M1005)]
C40  330pF/50V  [CAP_0402_(M1005)]
C41  0.1uF/10V  [CAP_0402_(M1005)]
C42  1uF/10V  [CAP_0402_(M1005)]
C43  0.1uF/10V  [CAP_0402_(M1005)]
C44  330pF/50V  [CAP_0402_(M1005)]
C45  0.1uF/10V  [CAP_0402_(M1005)]
C46  1uF/10V  [CAP_0402_(M1005)]
C47  0.1uF/10V  [CAP_0402_(M1005)]
C48  1uF/10V  [CAP_0402_(M1005)]
C49  10uF/10V  [CAP_0805_(M2012)]
C50  390pF/50V  [CAP_0402_(M1005)]
C51  39pF/50V  [CAP_0402_(M1005)]
C52  1uF/10V  [CAP_0402_(M1005)]
C53  0.1uF/10V  [CAP_0402_(M1005)]
C55  1uF/10V  [CAP_0402_(M1005)]
C56  47pF/50V  [CAP_0402_(M1005)]
C57  47pF/50V  [CAP_0402_(M1005)]
C58  0.1uF/10V  [CAP_0402_(M1005)]
C59  0.1uF/10V  [CAP_0402_(M1005)]
C61  10uF/10V  [CAP_0805_(M2012)]
C62  1uF/10V  [CAP_0402_(M1005)]
C63  39pF/50V  [CAP_0402_(M1005)]
C64  330pF/50V  [CAP_0402_(M1005)]
C66  330pF/50V  [CAP_0402_(M1005)]
C67  390pF/50V  [CAP_0402_(M1005)]
C68  39pF/50V  [CAP_0402_(M1005)]
C69  1uF/10V  [CAP_0402_(M1005)]
C78  0.1uF/10V  [CAP_0402_(M1005)]
D6  GG0402050R3C2P  [TVS_0402_(M1005)_BI-DIRECTIONAL]
D7  GG0402050R3C2P  [TVS_0402_(M1005)_BI-DIRECTIONAL]
D11  GG0402050R3C2P  [TVS_0402_(M1005)_BI-DIRECTIONAL]
J3  0530470210  [0530470210]
J4  0530470210  [0530470210]
L13  value BLM18PG121SN1D  [IND_0603_(M1608)]  (hidden comment: BLM18PG181SN1D)
L14  6.8nH  [IND_0402_(M1005)]
L15  value BLM18PG121SN1D  [IND_0603_(M1608)]  (hidden comment: BLM18PG181SN1D)
L16  value BLM18PG121SN1D  [IND_0603_(M1608)]  (hidden comment: BLM18PG181SN1D)
R8  0R  [RES_0402_(M1005)]
R15  0R  [RES_0402_(M1005)]
R27  10K  [RES_0402_(M1005)]
R28  30K  [RES_0402_(M1005)]
R29  0R  [RES_0402_(M1005)]
R30  0R  [RES_0402_(M1005)]
R31  30K  [RES_0402_(M1005)]
R32  0R  [RES_0402_(M1005)]
R33  10K  [RES_0402_(M1005)]
R34  1K  [RES_0402_(M1005)]
R35  10K  [RES_0402_(M1005)]
R36  4.7K  [RES_0402_(M1005)]
R37  4.7K  [RES_0402_(M1005)]
R38  0R  [RES_0402_(M1005)]
R39  30K  [RES_0402_(M1005)]
R40  0R  [RES_0402_(M1005)]
R41  30K  [RES_0402_(M1005)]
R42  0R  [RES_0402_(M1005)]
R43  10K  [RES_0402_(M1005)]
R44  1K  [RES_0402_(M1005)]
R45  10K  [RES_0402_(M1005)]
S1  RV0971GS  [RV0971GS]
TP8  TP  [TestP SM 30MIL ROUND]  (value not drawn)  (no BOM)
TP9  TP  [TestP SM 30MIL ROUND]  (value not drawn)  (no BOM)
TP17  TP  [TestP SM 30MIL ROUND]  (value not drawn)  (no BOM)
U5  NS4150  [SOP-8]
U6  TLV320DAC32IRHBR  [VQFN32]
U7  NS4150  [SOP-8]

### Nets
3V3_MCU: C45.2 C55.2 L16.2 R27.1 R33.2 R36.2 R37.2 R43.2 U6.5(LDO_SELECT) U6.7(IOVDD)
AUGND: C34.1 C35.1 C36.1 C37.1 C39.1 C40.1 C41.1 C42.1 C44.2 C46.1 C48.1 C49.1 C51.1 C52.1 C61.1 C62.1 C63.1 C64.1 C66.2 C68.1 C69.1 R15.1 R35.1 R45.1 TP17.1 U5.7(GND) U6.17(DRVSS) U6.21(DRVSS) U6.26(AVSS_DAC) U6.27(AVSS_DAC) U6.28(AVSS_DAC) U6.29(AVSS_DAC) U6.30(AVSS_DAC) U7.7(GND)
GND: C38.1 C45.1 C47.1 C55.1 C56.2 C57.2 C59.1 C78.1 D6.2 D7.2 D11.2 R15.2 U6.6(IOVSS)
VBAT_LDO: L13.1 L15.1 R38.2
VBAT_SW: S1.SW1
DAC_RST: R29.1 ; off-sheet DAC_RST
I2C_DAC_SCL: C57.1 R37.1 TP8.1 U6.8(SCL) ; off-sheet I2C_DAC_SCL
I2C_DAC_SDA: C56.1 R36.1 TP9.1 U6.9(SDA) ; off-sheet I2C_DAC_SDA
I2S_BCLK: U6.2(BCLK) ; off-sheet I2S_BCLK
I2S_DIN: U6.4(DIN) ; off-sheet I2S_DIN
I2S_MCLK: U6.1(MCLK) ; off-sheet I2S_MCLK
I2S_WCLK: U6.3(WCLK) ; off-sheet I2S_WCLK
OUT+_L: S1.6(CW) U6.19(HPLOUT)
OUT+_R: S1.3(CW) U6.23(HPROUT)
OUT-_L: C43.1 C51.2 S1.4(CCW) U6.20(HPLCOM)
OUT-_R: C58.1 C68.2 S1.1(CCW) U6.22(HPRCOM)
PA_INL+: R28.1 U5.3(INP)
PA_INL-: R31.1 U5.4(INN)
PA_INR+: R39.1 U7.3(INP)
PA_INR-: R41.1 U7.4(INN)
PA_OUTL+: R30.1 U5.8(VoP)
PA_OUTL-: R32.1 U5.5(VoN)
PA_OUTR+: R40.1 U7.8(VoP)
PA_OUTR-: R42.1 U7.5(VoN)
SPKR_EN_LR: R8.1 R34.1 R44.1 ; off-sheet SPKR_EN_LR
SPKR_L: C10.1 C39.2 C59.2 D7.1 S1.5(WPR)
SPKR_R: C53.1 C63.2 C78.2 D6.1 S1.2(WPR)
NetC10_2: C10.2 R28.2
NetC34_2: C34.2 C35.2 C41.2 C42.2 C46.2 C48.2 C49.2 L16.1 U6.18(DRVDD) U6.24(DRVDD) U6.25(AVDD_DAC)
NetC36_2: C36.2 C37.2 L13.2 U5.6(VCC)
NetC38_2: C38.2 L14.1 R27.2 R29.2
NetC40_2: C40.2 C50.2 J4.1(POS) R30.2
NetC43_2: C43.2 R31.2
NetC44_1: C44.1 C50.1 J4.2(NEG) R32.2
NetC47_2: C47.2 U6.32(DVDD)
NetC52_2: C52.2 U5.2(Bypass)
NetC53_2: C53.2 R39.2
NetC58_2: C58.2 R41.2
NetC61_2: C61.2 C62.2 L15.2 U7.6(VCC)
NetC64_2: C64.2 C67.2 J3.1(POS) R40.2
NetC66_1: C66.1 C67.1 J3.2(NEG) R42.2
NetC69_2: C69.2 U7.2(Bypass)
NetD11_1: D11.1 R38.1 S1.SW2
NetL14_2: L14.2 U6.31(~{RESET})
NetR8_2: R8.2 U6.15(MICBIAS)
NetR33_1: R33.1 R34.2 R35.2 U5.1(CTRL)
NetR43_1: R43.1 R44.2 R45.2 U7.1(CTRL)

Not connected (* = marked no-connect by the designer): U6 10(LINEL)* 11(LINEL)* 12(LINEL)* 13(LINER)* 14(LINER)* 16(MICBIAS)*

### Notes on the sheet
- DAC
- SPEAKER AMPLIFIER-LEFT
- (near J4) LEFT SPEAKER
- (near U6) LDO ON
- (near U6) LDO_SELECT = 1
- When SPKR_EN_LR control using DAC then do changes as per below
  Mount R8 & Unmount R6
  Mount R35 and R45 with 35K( as MIC BIAS support voltage 2.5V)
- SPEAKER AMPLIFIER-RIGHT
- ON/Off/ Volume control
- (near S1) POT - VOLUME
- (near J3) RIGHT SPEAKER
- Sheet Name
- Project
- Date:
- Revision :
- Customer Name
- Sheet:
- of

### Library data of the parts
C10 C34 C35 C38 C41 C43 C45 C47 C53 C58 C59 C78 = CAP_1: as C13 on sheet S2_WirelessAudio_CC8530; Value: 0.1uF/10V
C36 C49 C61 = CAP_10uF/16V_0805: =Description1; Manufacturer 1: Samsung Electro-Mechanics; Manufacturer Part Number 1: CL21A106KPFNNNG; Description1: CAP CER 10UF 10V X5R 0805; Cross Allowed: YES; Value: 10uF/10V
C37 C42 C46 C48 C52 C55 C62 C69 = CAP_1uF/16v (10%): =Description1; Manufacturer 1: Murata Electronics; Manufacturer Part Number 1: GRM155R61A105KE15D; Description1: CAP CER 1UF 10V X5R 0402; Cross Allowed: YES; Value: 1uF/10V
C39 C51 C63 C68 = CAP_39pF/50V (±5%): =Description1; Manufacturer 1: Samsung Electro-Mechanics; Manufacturer Part Number 1: CL05C390JB5NNNC; Description1: CAP CER 39PF 50V C0G/NP0 0402; Cross Allowed: YES; Value: 39pF/50V
C40 C44 C64 C66 = CAP_330pF/50V (5%): =Description1; Manufacturer 1: Walsin Technology Corporation; Manufacturer Part Number 1: 0402N331J500CT; Description1: CAP CER 330PF 50V C0G/NP0 0402; Cross Allowed: YES; Value: 330pF/50V
C50 C67 = CAP_390pF/50V (5%): =Description1; Manufacturer 1: AVX Corporation; Manufacturer Part Number 1: 04025C391JAT2A; Description1: CAP CER 390PF 50V X7R 0402; Cross Allowed: YES; Value: 390pF/50V
C56 C57 = CAP NP: as C3 on sheet S1_POWER; VALUE: 47pF/50V
D6 D7 D11 = TVS-DIODE: =Description1; Manufacturer 1: AVX Corporation; Description1: TVS DIODE 5V 15.5V 0402; Cross Allowed: YES; Manufacturer Part Number 1: GG0402050R3C2P; VALUE: GG0402050R3C2P
J3 J4 = HDR1X2_speaker: =Description1; Manufacturer 1: Molex; Description1: CONN HEADER VERT 2POS 1.25MM; Cross Allowed: YES; Value: 0530470210; Manufacturer Part Number 1: 0530470210
L13 L15 L16 = BLM18PG181SN1D: =Description1; Manufacturer 1: Murata; Description1: FERRITE BEAD 120 OHM 0603 1LN; Cross Allowed: YES; Manufacturer Part Number 1: BLM18PG121SN1D
L14 = IND: as L2 on sheet S2_WirelessAudio_CC8530; Value: 6.8nH
R8 R30 R32 R40 R42 = RES_0R: as R3 on sheet S2_WirelessAudio_CC8530; Value: 0R
R15 R29 R38 = RC1206JR-070RL: as R9 on sheet S2_WirelessAudio_CC8530; Value: 0R
R27 = RESISTOR: as R1 on sheet S1_POWER; Value: 10K
R28 R31 R39 R41 = RES_30K_1%: =Description1; Manufacturer 1: Panasonic Electronic Components; Manufacturer Part Number 1: ERJ-2RKF3002X; Description1: RES SMD 30K OHM 1% 1/10W 0402; Cross Allowed: YES; Value: 30K
R33 R35 R43 R45 = RES_10K_1%: =Description1; Manufacturer 1: Stackpole Electronics Inc; Manufacturer Part Number 1: RMCF0402FT10K0; Description1: RES 10K OHM 1% 1/16W 0402; Cross Allowed: YES; Value: 10K
R34 R44 = RES_0R: =Description1; Manufacturer 1: Stackpole Electronics Inc; Manufacturer Part Number 1: RMCF0402FT1K00; Description1: RES 1K OHM 1% 1/16W 0402; Cross Allowed: YES; Value: 1K
R36 R37 = RES: =Description1; Manufacturer 1: Stackpole Electronics Inc; Manufacturer Part Number 1: RMCF0402FT4K70; Description1: RES 4.7K OHM 1% 1/16W 0402; Cross Allowed: YES; VALUE: 4.7K
S1 = RV0971GS: =Description1; Description1: Potentiometer; Cross Allowed: YES; Manufacturer Part Number 1: RV0971GS; Value: RV0971GS
TP8 TP9 TP17 = TP: as TP1 on sheet S1_POWER; Manufacturer 1: NA; Manufacturer Part Number 1: NA
U5 = NS4150: =Description1; Manufacturer 1: NSIWAY; Description1: Low EMI,Filterless,3W Mono Class D Audio Amplifier; Cross Allowed: NO; Value: NS4150; Manufacturer Part Number 1: NS4150
U6 = TLV320DAC32: =Description1; Manufacturer 1: Texas Instruments; Cross Allowed: NO; Description1: IC DAC 24BIT 96K 32VQFN; Value: TLV320DAC32IRHBR; Manufacturer Part Number 1: TLV320DAC32IRHBR
U7 = NS4150: =Description1; Manufacturer 1: NSIWAY; Description1: Low EMI,Filterless,3W Mono Class D Audio Amplifier,SOP-8; Cross Allowed: NO; Value: NS4150; Manufacturer Part Number 1: NS4150

## Nets that join several sheets
3V3_MCU: S1_POWER (C2.2 TP1.1 U1.5), S2_WirelessAudio_CC8530 (10 pins), S3_CHAIR_SPKR-AMP+SPK (10 pins)
GND: S1_POWER (20 pins), S2_WirelessAudio_CC8530 (53 pins), S3_CHAIR_SPKR-AMP+SPK (13 pins)
VBAT: S1_POWER (9 pins), S2_WirelessAudio_CC8530 (R19.2)
VBAT_LDO: S1_POWER (C1.2 R1.1 U1.1), S3_CHAIR_SPKR-AMP+SPK (L13.1 L15.1 R38.2)
VBAT_SW: S1_POWER (D8.K D9.K R2.2 R7.2), S3_CHAIR_SPKR-AMP+SPK (S1.SW1)
VCHRG: S1_POWER (6 pins), S2_WirelessAudio_CC8530 (R21.2)
DAC_RST: S2_WirelessAudio_CC8530 (U3.17), S3_CHAIR_SPKR-AMP+SPK (R29.1)
I2C_DAC_SCL: S2_WirelessAudio_CC8530 (U3.32), S3_CHAIR_SPKR-AMP+SPK (C57.1 R37.1 TP8.1 U6.8)
I2C_DAC_SDA: S2_WirelessAudio_CC8530 (U3.33), S3_CHAIR_SPKR-AMP+SPK (C56.1 R36.1 TP9.1 U6.9)
I2S_BCLK: S2_WirelessAudio_CC8530 (L8.1 TP11.1), S3_CHAIR_SPKR-AMP+SPK (U6.2)
I2S_DIN: S2_WirelessAudio_CC8530 (L10.1 TP13.1), S3_CHAIR_SPKR-AMP+SPK (U6.4)
I2S_MCLK: S2_WirelessAudio_CC8530 (L7.1 TP14.1), S3_CHAIR_SPKR-AMP+SPK (U6.1)
I2S_WCLK: S2_WirelessAudio_CC8530 (L9.1 TP12.1), S3_CHAIR_SPKR-AMP+SPK (U6.3)
SPKR_EN_LR: S2_WirelessAudio_CC8530 (R6.2), S3_CHAIR_SPKR-AMP+SPK (R8.1 R34.1 R44.1)

## Assembly variants
PROTO: not fitted C28 C29 C50 C67 C77 CLP1 CLP2 CLP3 D5 D6 D7 D8 D10 D11 DM1 J5 P1 R2 R7 R8 R9 R12 R15 R20 R35 R45 U4